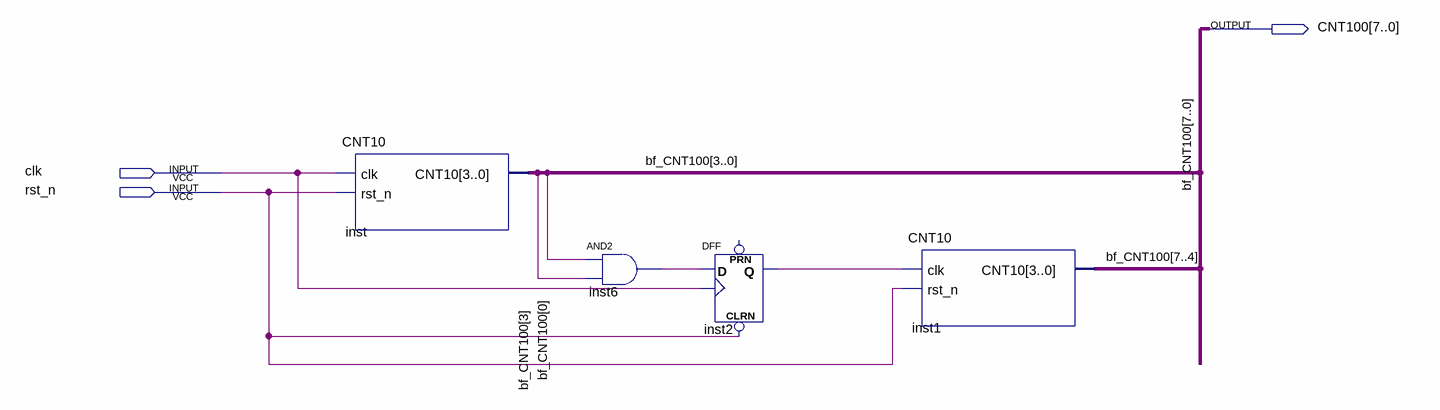
[diagram p0: schematic sheet]
// Quartus schematic CNT100.bdf as structural Verilog: 4 symbols, 3 pins
module CNT100 (
  input  clk,
  input  rst_n,
  output [7:0] CNT100
);

  wire inst2_q, inst6_out;

  CNT10 inst (.clk(clk), .rst_n(rst_n), .CNT10(CNT100[3:0]));
  and inst6 (inst6_out, CNT100[0], CNT100[3]);
  DFF inst2 (.CLRN(rst_n), .CLK(clk), .D(inst6_out), .Q(inst2_q));  // open: PRN
  CNT10 inst1 (.clk(inst2_q), .rst_n(rst_n), .CNT10(CNT100[7:4]));

  // Other names for the same wires on the sheet: bf_CNT100[7:0] = CNT100
endmodule
